# Altium schematic sheet gpio_expander.SchDoc
size A4; SheetNumber: 6; SheetTotal: 6
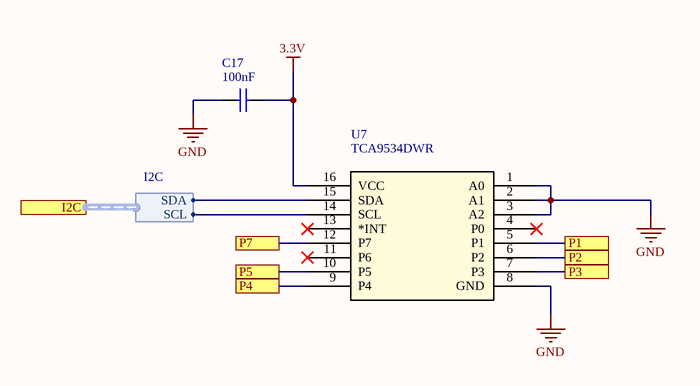
[diagram p0: gpio_expander.SchDoc]

## Parts
C17  value 100nF  [0603 - Capacitor]  (hidden comment: Capacitor - Nonpolarized)
U7  TCA9534DWR  [TCA9534DWR]

## Ports
I2C (harness I2C), P1, P2, P3, P4, P5, P7

## Harnesses
I2C: SCL, SDA

## Nets
3.3V: C17.2 U7.16(VCC)
GND: C17.1 U7.1(A0) U7.2(A1) U7.3(A2) U7.8(GND)
P1: U7.5(P1) ; port P1
P2: U7.6(P2) ; port P2
P3: U7.7(P3) ; port P3
P4: U7.9(P4) ; port P4
P5: U7.10(P5) ; port P5
P7: U7.12(P7) ; port P7
NetU7_14: U7.14(SCL) ; port I2C.SCL
NetU7_15: U7.15(SDA) ; port I2C.SDA

Not connected (* = marked no-connect by the designer): U7 4(P0)* 11(P6)* 13(*INT)*

## Library data of the parts
C17 = Capacitor - Nonpolarized: Nonpolarized Capacitor; Supplier Part Number: *; Supplier: *; Manufacturer: *; Rating: *; Manufacturer Part Number: *
U7 = TCA9534DWR: Low Voltage 8-Bit I2C and SMBUS Low-Power I/O Expander with Interrupt / Output and Configuration Registers; Mfr_Name: Texas Instruments; Copyright: Copyright (C) 2022 Ultra Librarian. All rights reserved.; Manufacturer_Part_Number: TCA9534DWR; Digi-Key_Part_Number_1: 296-47827-1-ND; Digi-Key_Part_Number_2: 296-47827-2-ND; Digi-Key_Part_Number_3: 296-47827-6-ND; RefDes: RefDes; Type: DEV